# Altium schematic sheet Buffer_EXC.SchDoc
size A4; CompanyName: Technische Hochschule Nürnberg Georg Simon Ohm; Organization: UltraZohm; Address1: Kesslerplatz 12; Address2: 90489 Nürnberg; Address3: GERMANY; DocumentNumber: 11; SheetNumber: 11; SheetTotal: 12; Website: www.ultrazohm.com
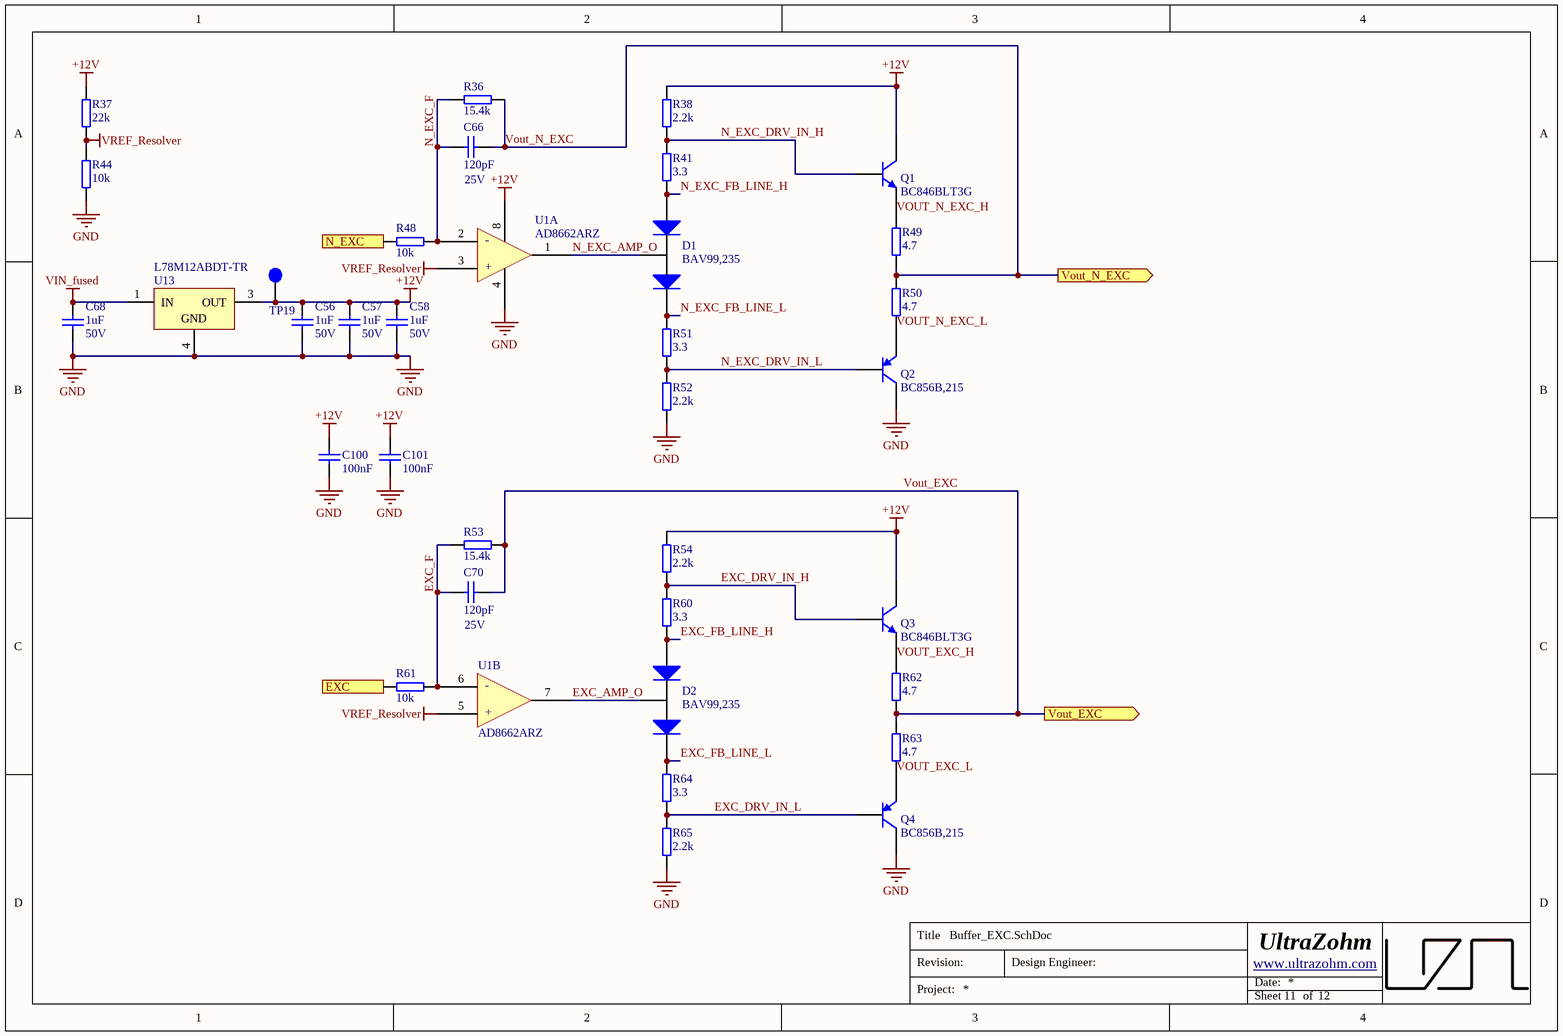
[diagram p0: Buffer_EXC.SchDoc]

## Parts
C56  1uF  Voltage: 50V  [RES_1206]
C57  1uF  Voltage: 50V  [RES_1206]
C58  1uF  Voltage: 50V  [RES_1206]
C66  120pF  Voltage: 25V  [CAPC1608X07N]
C68  1uF  Voltage: 50V  [RES_1206]
C70  120pF  Voltage: 25V  [CAPC1608X07N]
C100  100nF  [CAPC1608X07N]
C101  100nF  [CAPC1608X07N]
D1  BAV99,235  [SOT-23]
D2  BAV99,235  [SOT-23]
Q1  BC846BLT3G  [SOT-23]
Q2  BC856B,215  [SOT-23]
Q3  BC846BLT3G  [SOT-23]
Q4  BC856B,215  [SOT-23]
R36  15.4k  [RESC1608X06N]
R37  22k  [RESC1608X06N]
R38  2.2k  [RESC1608X06N]
R41  3.3  [RESC1608X06N]
R44  10k  [RESC1608X06N]
R48  10k  [RESC1608X06N]
R49  4.7  [RESC1608X06N]
R50  4.7  [RESC1608X06N]
R51  3.3  [RESC1608X06N]
R52  2.2k  [RESC1608X06N]
R53  15.4k  [RESC1608X06N]
R54  2.2k  [RESC1608X06N]
R60  3.3  [RESC1608X06N]
R61  10k  [RESC1608X06N]
R62  4.7  [RESC1608X06N]
R63  4.7  [RESC1608X06N]
R64  3.3  [RESC1608X06N]
R65  2.2k  [RESC1608X06N]
TP19  VCC  [TP_1mm]  (value not drawn)
U1  AD8662ARZ  [SOIC8_N]  (parts A,B of 2)
U13  L78M12ABDT-TR  [TO-252_M]

## Ports
EXC (in), N_EXC (in), Vout_EXC (out), Vout_N_EXC (out)

## Nets
+12V: C56.1 C57.1 C58.1 C100.1 C101.1 Q1.3(C) Q3.3(C) R37.2 R38.2 R54.2 TP19.1 U1.8(v-) U13.3(OUT)
GND: C56.2 C57.2 C58.2 C68.2 C100.2 C101.2 Q2.3(C) Q4.3(C) R44.1 R52.2 R65.2 U1.4(v+) U13.4(GND)
VIN_fused: C68.1 U13.1(IN)
VREF_Resolver: R37.1 R44.2 U1.3(+in_a) U1.5(+in_b)
EXC: R61.2 ; port EXC
EXC_AMP_O: D2.3 U1.7(out_b)
EXC_DRV_IN_H: Q3.1(B) R54.1 R60.2
EXC_DRV_IN_L: Q4.1(B) R64.2 R65.1
EXC_F: C70.1 R53.1 R61.1 U1.6(-in_b)
EXC_FB_LINE_H: D2.1 R60.1
EXC_FB_LINE_L: D2.2 R64.1
N_EXC: R48.2 ; port N_EXC
N_EXC_AMP_O: D1.3 U1.1(out_a)
N_EXC_DRV_IN_H: Q1.1(B) R38.1 R41.2
N_EXC_DRV_IN_L: Q2.1(B) R51.2 R52.1
N_EXC_F: C66.1 R36.1 R48.1 U1.2(-in_a)
N_EXC_FB_LINE_H: D1.1 R41.1
N_EXC_FB_LINE_L: D1.2 R51.1
Vout_EXC: C70.2 R53.2 R62.2 R63.1 ; port Vout_EXC
VOUT_EXC_H: Q3.2(E) R62.1
VOUT_EXC_L: Q4.2(E) R63.2
Vout_N_EXC: C66.2 R36.2 R49.2 R50.1 ; port Vout_N_EXC
VOUT_N_EXC_H: Q1.2(E) R49.1
VOUT_N_EXC_L: Q2.2(E) R50.2

## Notes on the sheet
- Title
- Revision:
- Design Engineer:
- Date:
- Project:
- Sheet
- of
- (in symbol AD8662, part A) -; +
- (in symbol AD8662, part B) -; +

## Library data of the parts
C56-C58 C68 = Cap_1206: Capacitor; Digikey Part-Number: *; Value: 1uF; Manufacturer Part-Number: *
C66 C70 = Cap_0603: Value: 120pF; MF: *; MPN: *; Supplier 1: *; Supplier 2: *; Supplier Part Number 1: *; Supplier Part Number 2: *
C100 C101 = Cap_0603: MPN: 885012206071; MF: Würth; Voltage: 25V; Value: 100nF; Supplier 1: Mouser; Supplier 2: *; Supplier Part Number 1: 710-885012206071; Supplier Part Number 2: *
D1 D2 = Diode Array: DIODE ARRAY GP 100V 215MA SOT23; MF: Nexperia; Supplier Part Number 2: 1727-4311-1-ND; MPN: BAV99,235; Supplier 1: Mouser; Supplier 2: Digi-Key; Package: SOT-23-3; Supplier Part Number 1: 771-BAV99235
Q1 Q3 = NPN Transistor BC846: NPN Bipolar Transistor; MF: ON Semiconductor; Supplier Part Number 2: BC846BLT3GOSCT-ND; MPN: BC846BLT3G; Supplier 1: Mouser; Supplier 2: Digi-Key; Supplier Part Number 1: 863-BC846BLT3G; Package: SOT-23-3
Q2 Q4 = PNP Transistor BC846: PNP Bipolar Transistor; MF: Nexperia; Supplier Part Number 2: 1727-2925-1-ND; MPN: BC856B,215; Supplier Part Number 1: 771-BC856B-T/R; Supplier 1: Mouser; Supplier 2: Digi-Key; Package: SOT-23-3
R36 R38 R41 R44 R48 R51-R54 R60 R61 R64 R65 = R_0603: MPN: CRCW06030000Z0EAC; MF: Vishay; Supplier 1: Mouser; Supplier Part Number 1: 71-CRCW06030000Z0EAC
  R36 R53: Value: 15.4k
  R38 R52 R54 R65: Value: 2.2k
  R41 R51 R60 R64: Value: 3.3
  R44 R48 R61: Value: 10k
R37 = R_0603: Value: 22k; MF: *; MPN: *; Supplier 1: *; Supplier Part Number 1: *
R49 R50 R62 R63 = R_0603: MF: Vishay; Value: 4.7; Supplier 1: Mouser
TP19 = TP_1mm: Testpoint 1mm; Created: 2018_06_25_AGeiger; Value: Testpoint 1mm
U1 = AD8662: IC OPAMP GP 2 CIRCUIT 14SOIC; MF: Analog Devices; MPN: AD8662ARZ; Supplier Part Number 2: AD8662ARZ-ND; Package: SOIC-8; Supplier 1: Mouser; Supplier 2: Digi-Key; Supplier Part Number 1: 584-AD8662ARZ
U13 = CMP-0244-00186-1: Precision 500mA Regulator, 12V, 3-Pin DPAK, Tape and Reel; ComponentLink2Description: Datasheet; PackageDescription: 3-Pin Transistor Outline Package 2.28 mm Pitch, 9.7 mm Lead Span (DPAK); PackageVersion: 2011; ComponentLink2URL: http://www.st.com/internet/com/TECHNICAL_RESOURCES/TECHNICAL_LITERATURE/DATASHEET/CD00000448.pdf; ComponentLink1URL: http://www.st.com; PackageReference: TO-252; DatasheetVersion: 1/11/2010; ComponentLink1Description: Manufacturer URL